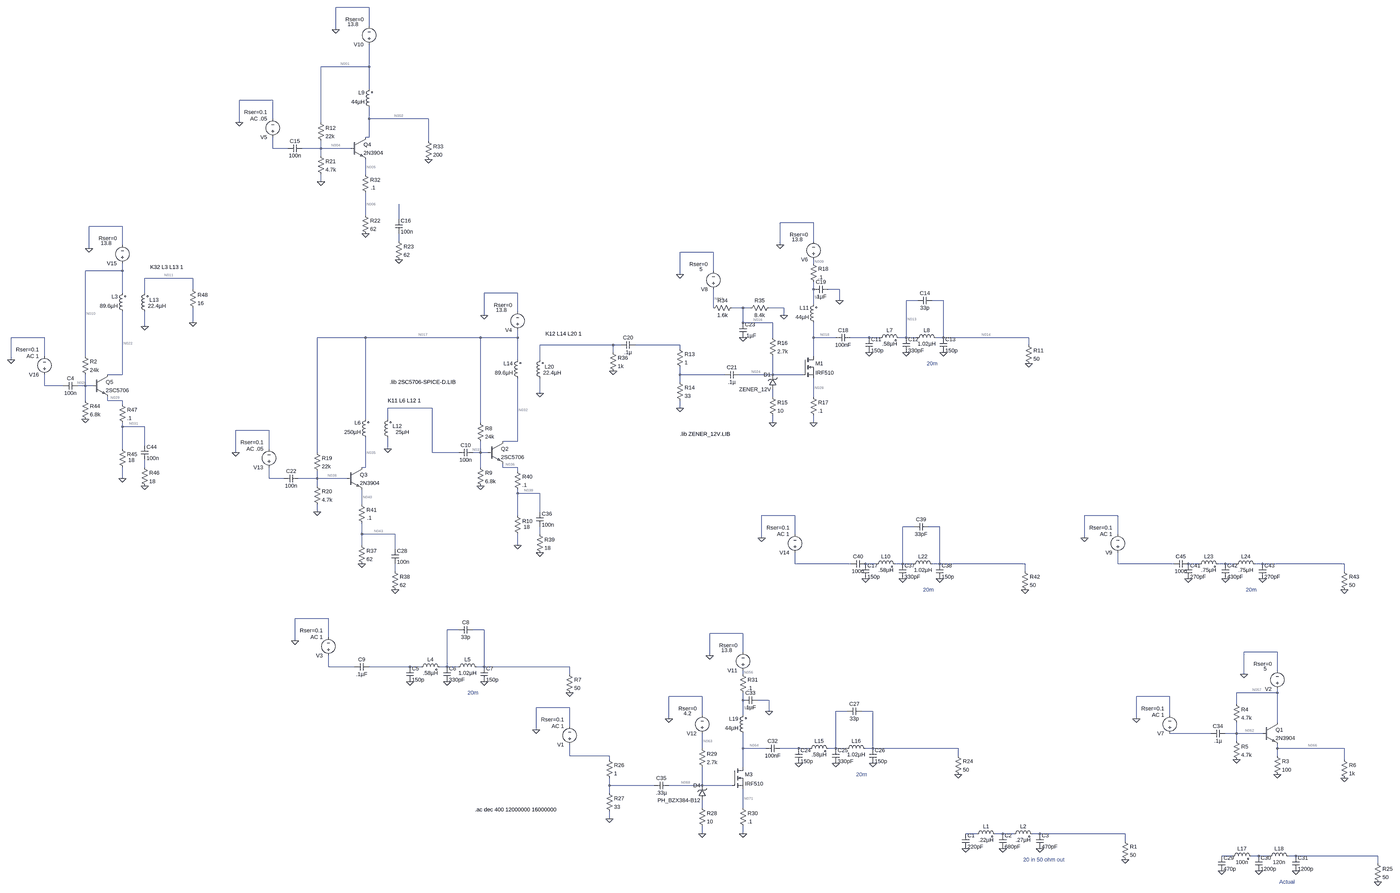
[diagram p0: schematic 10W IRF510 Amp - Impedance.asc, whole sheet]
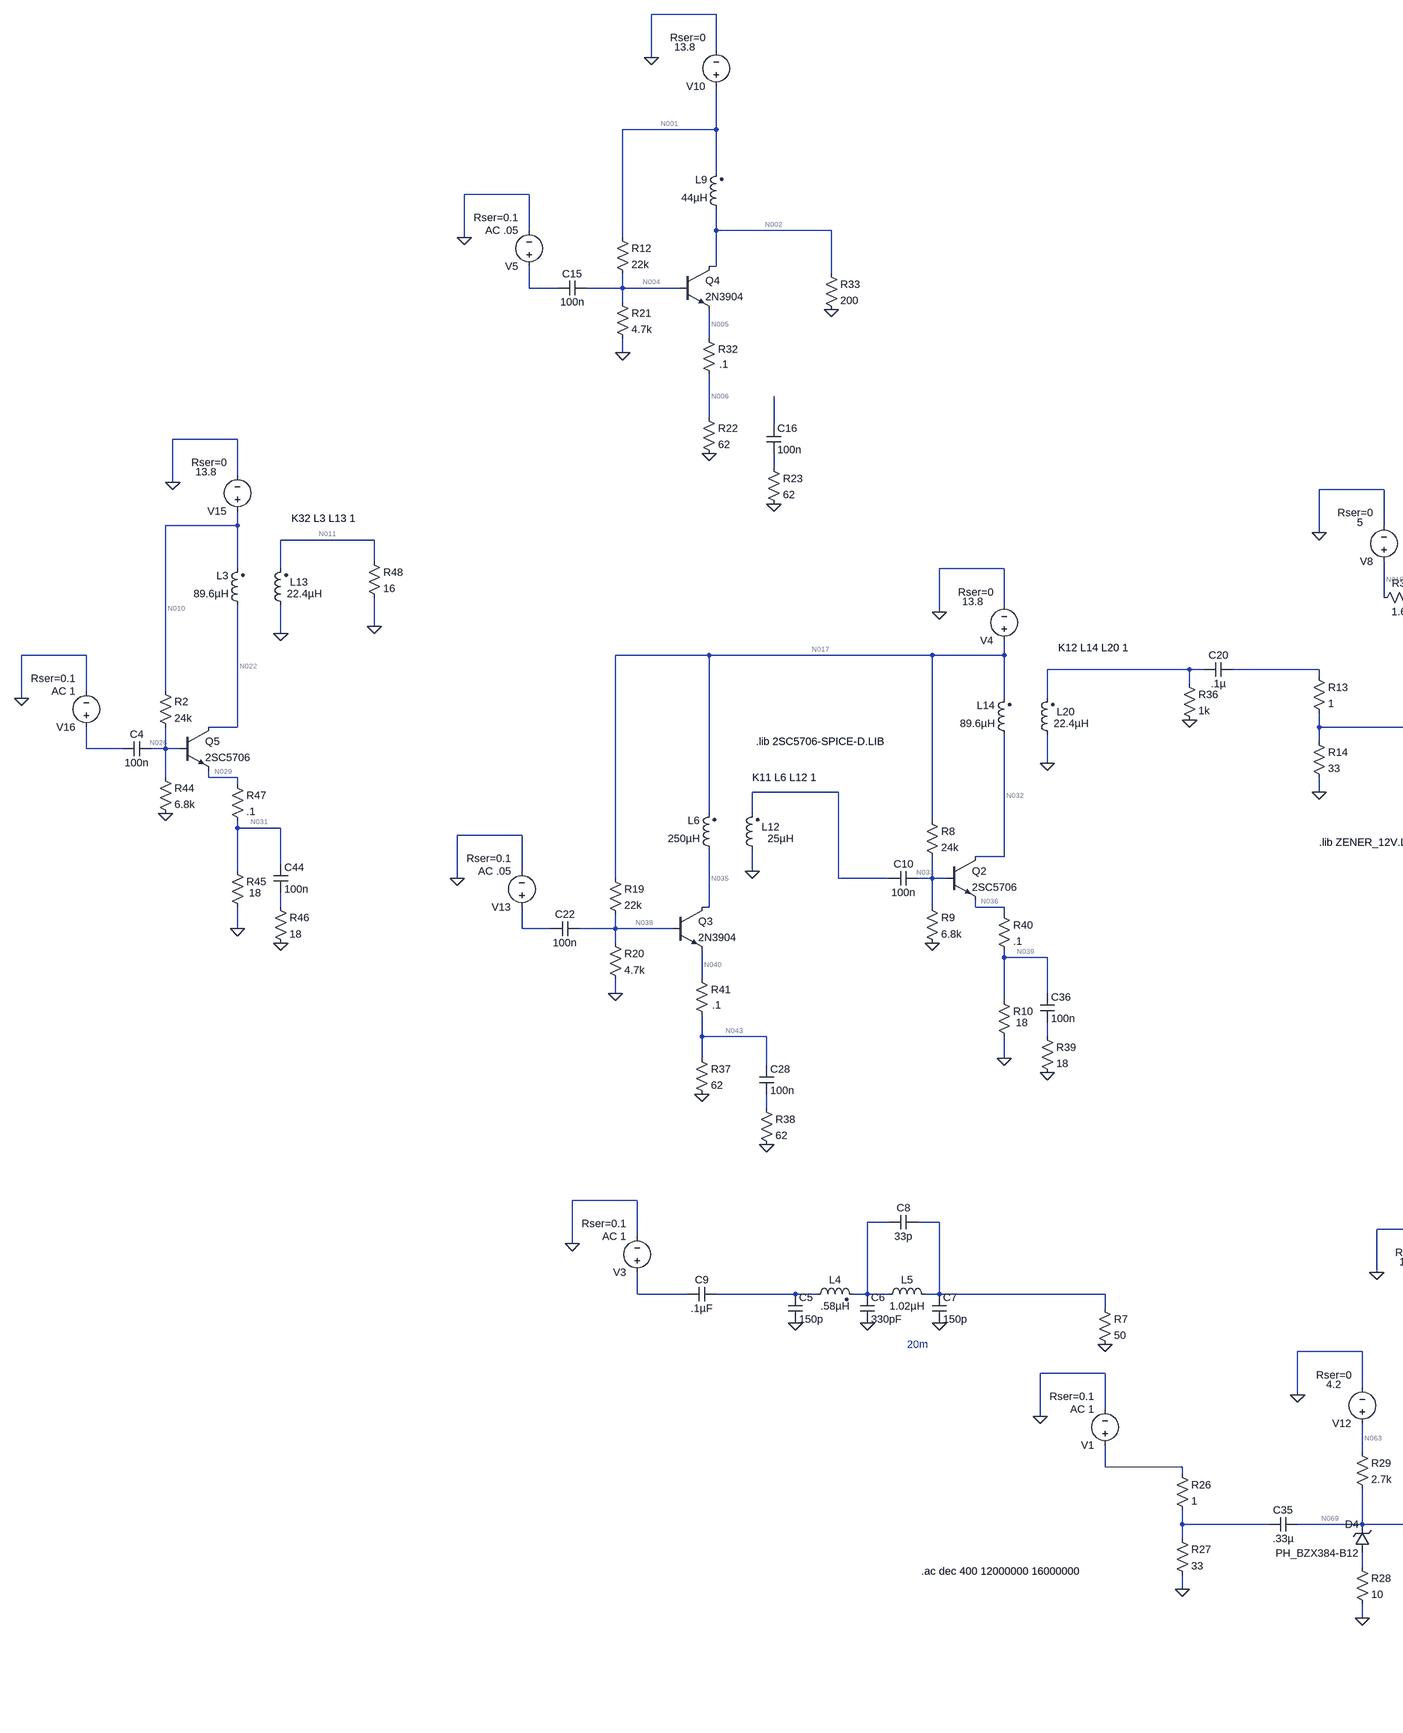
[diagram p1: schematic 10W IRF510 Amp - Impedance.asc, part, row 1 of 1, column 1 of 2]
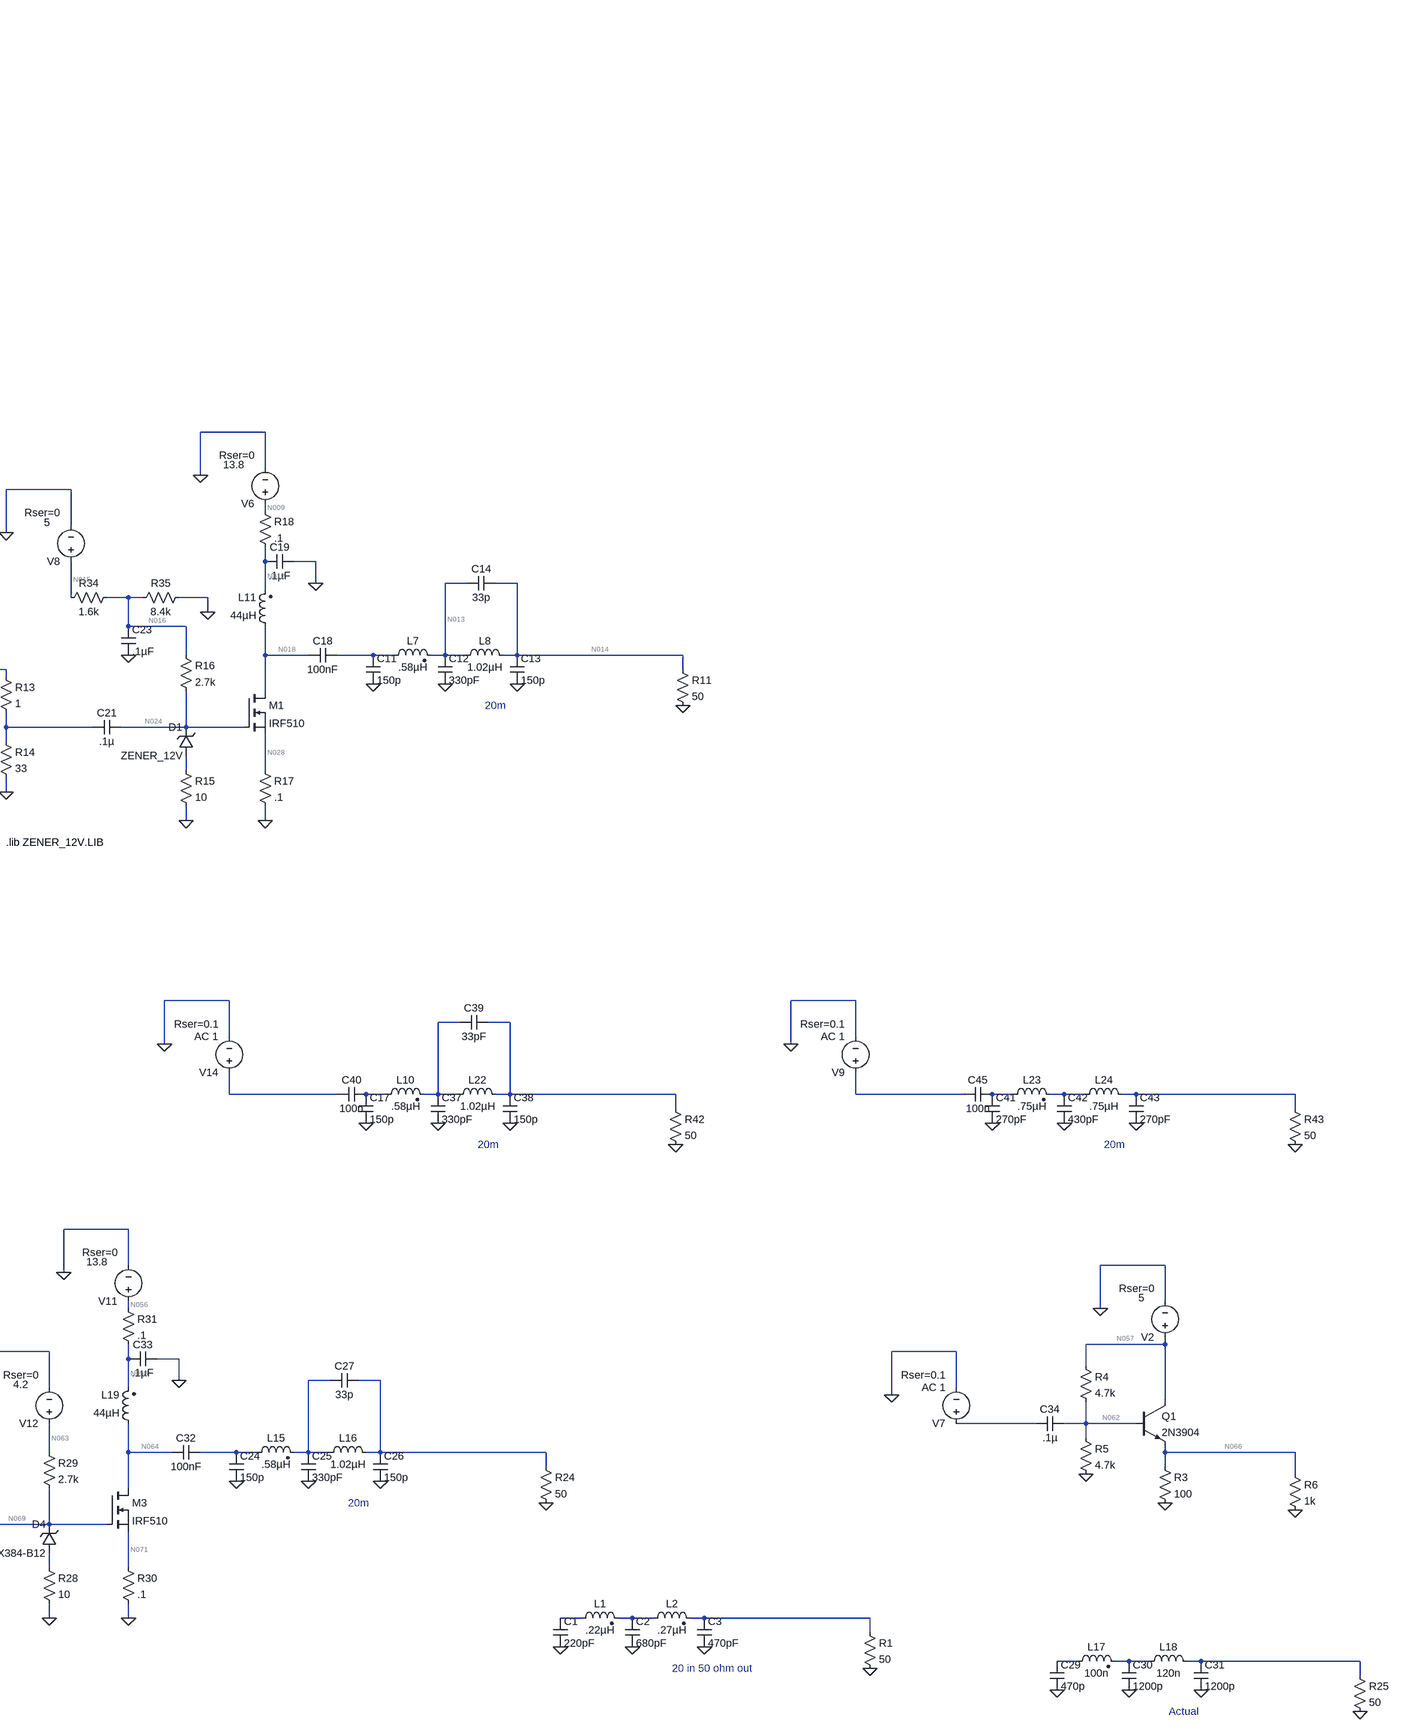
[diagram p2: schematic 10W IRF510 Amp - Impedance.asc, part, row 1 of 1, column 2 of 2]
10W IRF510 Amp - Impedance.asc, the LTspice schematic file:
Version 4
SHEET 1 3764 1240
WIRE -1216 -6752 -1360 -6752
WIRE -1216 -6672 -1216 -6752
WIRE -1360 -6656 -1360 -6752
WIRE -1216 -6496 -1216 -6592
WIRE -1216 -6496 -1424 -6496
WIRE -1216 -6400 -1216 -6496
WIRE -1632 -6352 -1776 -6352
WIRE -1632 -6272 -1632 -6352
WIRE -1216 -6272 -1216 -6320
WIRE -960 -6272 -1216 -6272
WIRE -1776 -6256 -1776 -6352
WIRE -1424 -6256 -1424 -6496
WIRE -1216 -6192 -1216 -6272
WIRE -1216 -6192 -1232 -6192
WIRE -960 -6176 -960 -6272
WIRE -1632 -6144 -1632 -6192
WIRE -1568 -6144 -1632 -6144
WIRE -1424 -6144 -1424 -6176
WIRE -1424 -6144 -1504 -6144
WIRE -1296 -6144 -1424 -6144
WIRE -1424 -6112 -1424 -6144
WIRE -1232 -6032 -1232 -6096
WIRE -1424 -6000 -1424 -6032
WIRE -1232 -5856 -1232 -5952
WIRE -1088 -5840 -1088 -5904
WIRE 720 -5824 576 -5824
WIRE -2320 -5808 -2464 -5808
WIRE -1088 -5744 -1088 -5776
WIRE 720 -5744 720 -5824
WIRE -2320 -5728 -2320 -5808
WIRE 576 -5728 576 -5824
WIRE -2464 -5712 -2464 -5808
WIRE 288 -5696 144 -5696
WIRE 720 -5648 720 -5664
WIRE -2320 -5616 -2320 -5648
WIRE -2320 -5616 -2480 -5616
WIRE 288 -5616 288 -5696
WIRE 144 -5600 144 -5696
WIRE -2016 -5584 -2224 -5584
WIRE -2016 -5536 -2016 -5584
WIRE 720 -5536 720 -5568
WIRE 832 -5536 784 -5536
WIRE -2320 -5520 -2320 -5616
WIRE -2224 -5520 -2224 -5584
WIRE -576 -5520 -720 -5520
WIRE 832 -5488 832 -5536
WIRE 1168 -5488 1120 -5488
WIRE 1280 -5488 1232 -5488
WIRE 720 -5472 720 -5536
WIRE 288 -5456 288 -5536
WIRE 416 -5456 368 -5456
WIRE 448 -5456 416 -5456
WIRE 592 -5456 528 -5456
WIRE -576 -5440 -576 -5520
WIRE -720 -5424 -720 -5520
WIRE 592 -5424 592 -5456
WIRE -2016 -5392 -2016 -5456
WIRE 416 -5392 416 -5456
WIRE 544 -5392 416 -5392
WIRE -2224 -5376 -2224 -5440
WIRE -2656 -5328 -2800 -5328
WIRE -1232 -5328 -1440 -5328
WIRE -736 -5328 -1232 -5328
WIRE -576 -5328 -576 -5360
WIRE -576 -5328 -736 -5328
WIRE 544 -5328 544 -5392
WIRE 720 -5328 720 -5392
WIRE 816 -5328 720 -5328
WIRE 960 -5328 880 -5328
WIRE 1008 -5328 960 -5328
WIRE 1120 -5328 1120 -5488
WIRE 1120 -5328 1088 -5328
WIRE 1168 -5328 1120 -5328
WIRE 1280 -5328 1280 -5488
WIRE 1280 -5328 1248 -5328
WIRE 1648 -5328 1280 -5328
WIRE -144 -5296 -480 -5296
WIRE -112 -5296 -144 -5296
WIRE 144 -5296 -48 -5296
WIRE 1648 -5296 1648 -5328
WIRE 144 -5280 144 -5296
WIRE -144 -5264 -144 -5296
WIRE -2656 -5248 -2656 -5328
WIRE -2480 -5248 -2480 -5616
WIRE 720 -5248 720 -5328
WIRE -2800 -5232 -2800 -5328
WIRE -576 -5232 -576 -5328
WIRE -480 -5232 -480 -5296
WIRE -2320 -5168 -2320 -5440
WIRE -2320 -5168 -2384 -5168
WIRE 144 -5168 144 -5200
WIRE 336 -5168 144 -5168
WIRE 544 -5168 544 -5248
WIRE 544 -5168 400 -5168
WIRE 672 -5168 544 -5168
WIRE 144 -5136 144 -5168
WIRE -2656 -5120 -2656 -5168
WIRE -2576 -5120 -2656 -5120
WIRE -2480 -5120 -2480 -5168
WIRE -2480 -5120 -2512 -5120
WIRE -2448 -5120 -2480 -5120
WIRE -480 -5088 -480 -5152
WIRE 544 -5072 544 -5104
WIRE 720 -5072 720 -5152
WIRE -2480 -5056 -2480 -5120
WIRE -2384 -5056 -2384 -5072
WIRE -2320 -5056 -2384 -5056
WIRE -2320 -5040 -2320 -5056
WIRE -944 -5024 -1136 -5024
WIRE 144 -5024 144 -5056
WIRE -1232 -4976 -1232 -5328
WIRE -1136 -4976 -1136 -5024
WIRE -736 -4960 -736 -5328
WIRE 544 -4960 544 -4992
WIRE 720 -4960 720 -4992
WIRE -2320 -4944 -2320 -4960
WIRE -2224 -4944 -2320 -4944
WIRE -1648 -4928 -1792 -4928
WIRE -576 -4880 -576 -5152
WIRE -576 -4880 -640 -4880
WIRE -2224 -4864 -2224 -4944
WIRE -2320 -4848 -2320 -4944
WIRE -1648 -4848 -1648 -4928
WIRE -1136 -4848 -1136 -4896
WIRE -1792 -4832 -1792 -4928
WIRE -1440 -4832 -1440 -5328
WIRE -944 -4832 -944 -5024
WIRE -832 -4832 -944 -4832
WIRE -736 -4832 -736 -4880
WIRE -736 -4832 -768 -4832
WIRE -704 -4832 -736 -4832
WIRE -2224 -4768 -2224 -4800
WIRE -1232 -4768 -1232 -4896
WIRE -1232 -4768 -1248 -4768
WIRE -736 -4768 -736 -4832
WIRE -640 -4768 -640 -4784
WIRE -576 -4768 -640 -4768
WIRE -576 -4752 -576 -4768
WIRE -2320 -4720 -2320 -4768
WIRE -1648 -4720 -1648 -4768
WIRE -1584 -4720 -1648 -4720
WIRE -1440 -4720 -1440 -4752
WIRE -1440 -4720 -1520 -4720
WIRE -1312 -4720 -1440 -4720
WIRE -1440 -4688 -1440 -4720
WIRE -576 -4656 -576 -4672
WIRE -480 -4656 -576 -4656
WIRE -1248 -4608 -1248 -4672
WIRE -1440 -4576 -1440 -4608
WIRE -480 -4576 -480 -4656
WIRE -576 -4560 -576 -4656
WIRE 640 -4560 496 -4560
WIRE 2032 -4560 1888 -4560
WIRE 1152 -4512 1104 -4512
WIRE 1264 -4512 1216 -4512
WIRE -1248 -4480 -1248 -4528
WIRE -1104 -4480 -1248 -4480
WIRE -480 -4480 -480 -4512
WIRE 640 -4480 640 -4560
WIRE 2032 -4480 2032 -4560
WIRE 496 -4464 496 -4560
WIRE 1888 -4464 1888 -4560
WIRE -1248 -4432 -1248 -4480
WIRE -576 -4432 -576 -4480
WIRE -1104 -4416 -1104 -4480
WIRE 640 -4352 640 -4400
WIRE 880 -4352 640 -4352
WIRE 992 -4352 944 -4352
WIRE 1104 -4352 1104 -4512
WIRE 1104 -4352 1072 -4352
WIRE 1152 -4352 1104 -4352
WIRE 1264 -4352 1264 -4512
WIRE 1264 -4352 1232 -4352
WIRE 1632 -4352 1264 -4352
WIRE 2032 -4352 2032 -4400
WIRE 2272 -4352 2032 -4352
WIRE 2384 -4352 2336 -4352
WIRE 2496 -4352 2464 -4352
WIRE 2544 -4352 2496 -4352
WIRE 2656 -4352 2624 -4352
WIRE 3024 -4352 2656 -4352
WIRE -1104 -4320 -1104 -4352
WIRE 1632 -4320 1632 -4352
WIRE 3024 -4320 3024 -4352
WIRE -1392 -3616 -1536 -3616
WIRE -832 -3568 -880 -3568
WIRE -720 -3568 -768 -3568
WIRE 416 -3552 272 -3552
WIRE -1392 -3536 -1392 -3616
WIRE -1536 -3520 -1536 -3616
WIRE 416 -3472 416 -3552
WIRE 2720 -3472 2576 -3472
WIRE 272 -3456 272 -3552
WIRE -1392 -3408 -1392 -3456
WIRE -1280 -3408 -1392 -3408
WIRE -1040 -3408 -1216 -3408
WIRE -992 -3408 -1040 -3408
WIRE -880 -3408 -880 -3568
WIRE -880 -3408 -912 -3408
WIRE -832 -3408 -880 -3408
WIRE -720 -3408 -720 -3568
WIRE -720 -3408 -752 -3408
WIRE -352 -3408 -720 -3408
WIRE 2720 -3392 2720 -3472
WIRE -352 -3376 -352 -3408
WIRE 416 -3376 416 -3392
WIRE 2576 -3376 2576 -3472
WIRE 2720 -3296 2720 -3312
WIRE 2720 -3296 2544 -3296
WIRE 240 -3280 96 -3280
WIRE 2256 -3280 2112 -3280
WIRE 416 -3264 416 -3296
WIRE 528 -3264 480 -3264
WIRE 2544 -3248 2544 -3296
WIRE -352 -3232 -496 -3232
WIRE 528 -3216 528 -3264
WIRE 864 -3216 816 -3216
WIRE 976 -3216 928 -3216
WIRE 240 -3200 240 -3280
WIRE 416 -3200 416 -3264
WIRE 2256 -3200 2256 -3280
WIRE 96 -3184 96 -3280
WIRE 2112 -3184 2112 -3280
WIRE 2720 -3168 2720 -3296
WIRE -352 -3152 -352 -3232
WIRE -496 -3136 -496 -3232
WIRE 2432 -3120 2256 -3120
WIRE 2544 -3120 2544 -3168
WIRE 2544 -3120 2496 -3120
WIRE 2656 -3120 2544 -3120
WIRE 2544 -3088 2544 -3120
WIRE 240 -3056 240 -3120
WIRE 416 -3056 416 -3120
WIRE 512 -3056 416 -3056
WIRE 656 -3056 576 -3056
WIRE 704 -3056 656 -3056
WIRE 816 -3056 816 -3216
WIRE 816 -3056 784 -3056
WIRE 864 -3056 816 -3056
WIRE 976 -3056 976 -3216
WIRE 976 -3056 944 -3056
WIRE 1344 -3056 976 -3056
WIRE 2720 -3056 2720 -3072
WIRE 3024 -3056 2720 -3056
WIRE -352 -3024 -352 -3072
WIRE -160 -3024 -352 -3024
WIRE 1344 -3024 1344 -3056
WIRE 2720 -3024 2720 -3056
WIRE -160 -3008 -160 -3024
WIRE 3024 -3008 3024 -3056
WIRE 416 -2976 416 -3056
WIRE -160 -2896 -160 -2928
WIRE 32 -2896 -160 -2896
WIRE 240 -2896 240 -2976
WIRE 240 -2896 96 -2896
WIRE 368 -2896 240 -2896
WIRE -160 -2864 -160 -2896
WIRE 240 -2800 240 -2832
WIRE 416 -2800 416 -2880
WIRE -160 -2752 -160 -2784
WIRE 240 -2688 240 -2720
WIRE 416 -2688 416 -2720
WIRE 1424 -2688 1376 -2688
WIRE 1536 -2688 1504 -2688
WIRE 1584 -2688 1536 -2688
WIRE 1696 -2688 1664 -2688
WIRE 2064 -2688 1696 -2688
WIRE 2064 -2656 2064 -2688
WIRE 2528 -2592 2480 -2592
WIRE 2640 -2592 2608 -2592
WIRE 2688 -2592 2640 -2592
WIRE 2800 -2592 2768 -2592
WIRE 3168 -2592 2800 -2592
WIRE 3168 -2560 3168 -2592
FLAG 2112 -3184 0
FLAG 1344 -2944 0
FLAG 656 -2992 0
FLAG 816 -2992 0
FLAG 976 -2992 0
FLAG 3168 -2480 0
FLAG 2480 -2528 0
FLAG 2640 -2528 0
FLAG 2800 -2528 0
FLAG 272 -3456 0
FLAG 528 -3216 0
FLAG -160 -2752 0
FLAG 240 -2688 0
FLAG 416 -2688 0
FLAG 96 -3184 0
FLAG 2064 -2576 0
FLAG 1376 -2624 0
FLAG 1536 -2624 0
FLAG 1696 -2624 0
FLAG -496 -3136 0
FLAG 2720 -2944 0
FLAG 2576 -3376 0
FLAG 2544 -3008 0
FLAG 3024 -2928 0
FLAG -352 -3296 0
FLAG -1040 -3344 0
FLAG -880 -3344 0
FLAG -720 -3344 0
FLAG -1536 -3520 0
FLAG -720 -5424 0
FLAG -736 -4688 0
FLAG -576 -4432 0
FLAG 1648 -5216 0
FLAG 960 -5264 0
FLAG 1120 -5264 0
FLAG 1280 -5264 0
FLAG 576 -5728 0
FLAG 832 -5488 0
FLAG 144 -5024 0
FLAG 544 -4960 0
FLAG 720 -4960 0
FLAG 144 -5600 0
FLAG -1440 -4576 0
FLAG 592 -5424 0
FLAG 416 -5328 0
FLAG -144 -5184 0
FLAG -1248 -4352 0
FLAG -1104 -4240 0
FLAG -1136 -4848 0
FLAG -480 -4400 0
FLAG -480 -5088 0
FLAG -1792 -4832 0
FLAG -1424 -6000 0
FLAG -1232 -5776 0
FLAG -1088 -5664 0
FLAG -1776 -6256 0
FLAG -1360 -6656 0
FLAG -960 -6096 0
FLAG 1632 -4240 0
FLAG 944 -4288 0
FLAG 1104 -4288 0
FLAG 1264 -4288 0
FLAG 496 -4464 0
FLAG 3024 -4240 0
FLAG 2336 -4288 0
FLAG 2496 -4288 0
FLAG 2656 -4288 0
FLAG 1888 -4464 0
FLAG -2464 -5712 0
FLAG -2480 -4976 0
FLAG -2320 -4720 0
FLAG -2224 -4688 0
FLAG -2224 -5376 0
FLAG -2016 -5392 0
FLAG -2800 -5232 0
SYMBOL voltage 2256 -3104 R180
WINDOW 123 24 96 Left 2
WINDOW 39 24 124 Left 2
WINDOW 3 46 103 Left 2
SYMATTR Value2 AC 1
SYMATTR SpiceLine Rser=0.1
SYMATTR Value ""
SYMATTR InstName V7
SYMBOL res 1328 -3040 R0
SYMATTR InstName R24
SYMATTR Value 50
SYMBOL cap 640 -3056 R0
SYMATTR InstName C24
SYMATTR Value 150p
SYMBOL cap 800 -3056 R0
SYMATTR InstName C25
SYMATTR Value 330pF
SYMBOL cap 960 -3056 R0
SYMATTR InstName C26
SYMATTR Value 150p
SYMBOL ind2 688 -3040 R270
WINDOW 0 32 56 VTop 2
WINDOW 3 5 56 VBottom 2
SYMATTR InstName L15
SYMATTR Value .58µH
SYMATTR Type ind
SYMBOL ind 848 -3040 R270
WINDOW 0 32 56 VTop 2
WINDOW 3 5 56 VBottom 2
SYMATTR InstName L16
SYMATTR Value 1.02µH
SYMBOL cap 928 -3232 R90
WINDOW 0 0 32 VBottom 2
WINDOW 3 32 32 VTop 2
SYMATTR InstName C27
SYMATTR Value 33p
SYMBOL res 3152 -2576 R0
SYMATTR InstName R25
SYMATTR Value 50
SYMBOL cap 2464 -2592 R0
SYMATTR InstName C29
SYMATTR Value 470p
SYMBOL cap 2624 -2592 R0
SYMATTR InstName C30
SYMATTR Value 1200p
SYMBOL cap 2784 -2592 R0
SYMATTR InstName C31
SYMATTR Value 1200p
SYMBOL ind2 2512 -2576 R270
WINDOW 0 32 56 VTop 2
WINDOW 3 5 56 VBottom 2
SYMATTR InstName L17
SYMATTR Value 100n
SYMATTR Type ind
SYMBOL ind 2672 -2576 R270
WINDOW 0 32 56 VTop 2
WINDOW 3 5 56 VBottom 2
SYMATTR InstName L18
SYMATTR Value 120n
SYMBOL voltage 416 -3376 R180
WINDOW 123 0 0 Left 0
WINDOW 39 24 124 Left 2
WINDOW 3 46 103 Left 2
SYMATTR SpiceLine Rser=0
SYMATTR Value 13.8
SYMATTR InstName V11
SYMBOL ind2 432 -3104 R180
WINDOW 0 36 80 Left 2
WINDOW 3 36 40 Left 2
SYMATTR InstName L19
SYMATTR Value 44µH
SYMATTR Type ind
SYMBOL cap 576 -3072 R90
WINDOW 0 0 32 VBottom 2
WINDOW 3 32 32 VTop 2
SYMATTR InstName C32
SYMATTR Value 100nF
SYMBOL cap 480 -3280 R90
WINDOW 0 0 32 VBottom 2
WINDOW 3 32 32 VTop 2
SYMATTR InstName C33
SYMATTR Value .1µF
SYMBOL cap 2496 -3136 R90
WINDOW 0 0 32 VBottom 2
WINDOW 3 32 32 VTop 2
SYMATTR InstName C34
SYMATTR Value .1µ
SYMBOL zener 256 -2832 R180
WINDOW 0 24 64 Left 2
WINDOW 3 24 0 Left 2
SYMATTR InstName D4
SYMATTR Value PH_BZX384-B12
SYMBOL res -176 -3024 R0
SYMATTR InstName R26
SYMATTR Value 1
SYMBOL res -176 -2880 R0
SYMATTR InstName R27
SYMATTR Value 33
SYMBOL cap 96 -2912 R90
WINDOW 0 0 32 VBottom 2
WINDOW 3 32 32 VTop 2
SYMATTR InstName C35
SYMATTR Value .33µ
SYMBOL res 224 -2816 R0
SYMATTR InstName R28
SYMATTR Value 10
SYMBOL nmos 368 -2976 R0
SYMATTR InstName M3
SYMATTR Value IRF510
SYMBOL res 224 -3072 R0
SYMATTR InstName R29
SYMATTR Value 2.7k
SYMBOL voltage 240 -3104 R180
WINDOW 123 0 0 Left 0
WINDOW 39 24 124 Left 2
WINDOW 3 46 103 Left 2
SYMATTR SpiceLine Rser=0
SYMATTR Value 4.2
SYMATTR InstName V12
SYMBOL res 400 -2816 R0
SYMATTR InstName R30
SYMATTR Value .1
SYMBOL res 400 -3392 R0
SYMATTR InstName R31
SYMATTR Value .1
SYMBOL res 2048 -2672 R0
SYMATTR InstName R1
SYMATTR Value 50
SYMBOL cap 1360 -2688 R0
SYMATTR InstName C1
SYMATTR Value 220pF
SYMBOL cap 1520 -2688 R0
SYMATTR InstName C2
SYMATTR Value 680pF
SYMBOL cap 1680 -2688 R0
SYMATTR InstName C3
SYMATTR Value 470pF
SYMBOL ind2 1408 -2672 R270
WINDOW 0 32 56 VTop 2
WINDOW 3 5 56 VBottom 2
SYMATTR InstName L1
SYMATTR Value .22µH
SYMATTR Type ind
SYMBOL ind2 1568 -2672 R270
WINDOW 0 32 56 VTop 2
WINDOW 3 5 56 VBottom 2
SYMATTR InstName L2
SYMATTR Value .27µH
SYMATTR Type ind
SYMBOL voltage -352 -3056 R180
WINDOW 123 24 96 Left 2
WINDOW 39 24 124 Left 2
WINDOW 3 46 103 Left 2
SYMATTR Value2 AC 1
SYMATTR SpiceLine Rser=0.1
SYMATTR Value ""
SYMATTR InstName V1
SYMBOL npn 2656 -3168 R0
SYMATTR InstName Q1
SYMATTR Value 2N3904
SYMBOL res 2704 -3040 R0
SYMATTR InstName R3
SYMATTR Value 100
SYMBOL voltage 2720 -3296 R180
WINDOW 123 0 0 Left 0
WINDOW 39 24 124 Left 2
WINDOW 3 46 103 Left 2
SYMATTR SpiceLine Rser=0
SYMATTR Value 5
SYMATTR InstName V2
SYMBOL res 2528 -3264 R0
SYMATTR InstName R4
SYMATTR Value 4.7k
SYMBOL res 2528 -3104 R0
SYMATTR InstName R5
SYMATTR Value 4.7k
SYMBOL res 3008 -3024 R0
SYMATTR InstName R6
SYMATTR Value 1k
SYMBOL res -368 -3392 R0
SYMATTR InstName R7
SYMATTR Value 50
SYMBOL cap -1056 -3408 R0
SYMATTR InstName C5
SYMATTR Value 150p
SYMBOL cap -896 -3408 R0
SYMATTR InstName C6
SYMATTR Value 330pF
SYMBOL cap -736 -3408 R0
SYMATTR InstName C7
SYMATTR Value 150p
SYMBOL ind2 -1008 -3392 R270
WINDOW 0 32 56 VTop 2
WINDOW 3 5 56 VBottom 2
SYMATTR InstName L4
SYMATTR Value .58µH
SYMATTR Type ind
SYMBOL ind -848 -3392 R270
WINDOW 0 32 56 VTop 2
WINDOW 3 5 56 VBottom 2
SYMATTR InstName L5
SYMATTR Value 1.02µH
SYMBOL cap -768 -3584 R90
WINDOW 0 0 32 VBottom 2
WINDOW 3 32 32 VTop 2
SYMATTR InstName C8
SYMATTR Value 33p
SYMBOL voltage -1392 -3440 R180
WINDOW 123 24 96 Left 2
WINDOW 39 24 124 Left 2
WINDOW 3 46 103 Left 2
SYMATTR Value2 AC 1
SYMATTR SpiceLine Rser=0.1
SYMATTR Value ""
SYMATTR InstName V3
SYMBOL cap -1216 -3424 R90
WINDOW 0 0 32 VBottom 2
WINDOW 3 32 32 VTop 2
SYMATTR InstName C9
SYMATTR Value .1µF
SYMBOL npn -704 -4880 R0
SYMATTR InstName Q2
SYMATTR Value 2SC5706
SYMBOL voltage -576 -5344 R180
WINDOW 123 0 0 Left 0
WINDOW 39 24 124 Left 2
WINDOW 3 46 103 Left 2
SYMATTR SpiceLine Rser=0
SYMATTR Value 13.8
SYMATTR InstName V4
SYMBOL npn -1312 -4768 R0
SYMATTR InstName Q3
SYMATTR Value 2N3904
SYMBOL cap -768 -4848 R90
WINDOW 0 0 32 VBottom 2
WINDOW 3 32 32 VTop 2
SYMATTR InstName C10
SYMATTR Value 100n
SYMBOL res -752 -4976 R0
SYMATTR InstName R8
SYMATTR Value 24k
SYMBOL res -752 -4784 R0
SYMATTR InstName R9
SYMATTR Value 6.8k
SYMBOL ind2 -1216 -4880 R180
WINDOW 0 36 80 Left 2
WINDOW 3 36 40 Left 2
SYMATTR InstName L6
SYMATTR Value 250µH
SYMATTR Type ind
SYMBOL res -592 -4576 R0
WINDOW 3 42 65 Left 2
SYMATTR Value 18
SYMATTR InstName R10
SYMBOL res 1632 -5312 R0
SYMATTR InstName R11
SYMATTR Value 50
SYMBOL cap 944 -5328 R0
SYMATTR InstName C11
SYMATTR Value 150p
SYMBOL cap 1104 -5328 R0
SYMATTR InstName C12
SYMATTR Value 330pF
SYMBOL cap 1264 -5328 R0
SYMATTR InstName C13
SYMATTR Value 150p
SYMBOL ind2 992 -5312 R270
WINDOW 0 32 56 VTop 2
WINDOW 3 5 56 VBottom 2
SYMATTR InstName L7
SYMATTR Value .58µH
SYMATTR Type ind
SYMBOL ind 1152 -5312 R270
WINDOW 0 32 56 VTop 2
WINDOW 3 5 56 VBottom 2
SYMATTR InstName L8
SYMATTR Value 1.02µH
SYMBOL cap 1232 -5504 R90
WINDOW 0 0 32 VBottom 2
WINDOW 3 32 32 VTop 2
SYMATTR InstName C14
SYMATTR Value 33p
SYMBOL voltage 720 -5648 R180
WINDOW 123 0 0 Left 0
WINDOW 39 24 124 Left 2
WINDOW 3 46 103 Left 2
SYMATTR SpiceLine Rser=0
SYMATTR Value 13.8
SYMATTR InstName V6
SYMBOL ind2 736 -5376 R180
WINDOW 0 36 80 Left 2
WINDOW 3 36 40 Left 2
SYMATTR InstName L11
SYMATTR Value 44µH
SYMATTR Type ind
SYMBOL cap 880 -5344 R90
WINDOW 0 0 32 VBottom 2
WINDOW 3 32 32 VTop 2
SYMATTR InstName C18
SYMATTR Value 100nF
SYMBOL ind2 -1120 -4880 R180
WINDOW 0 -45 66 Left 2
WINDOW 3 -76 40 Left 2
SYMATTR InstName L12
SYMATTR Value 25µH
SYMATTR Type ind
SYMBOL cap 784 -5552 R90
WINDOW 0 0 32 VBottom 2
WINDOW 3 32 32 VTop 2
SYMATTR InstName C19
SYMATTR Value .1µF
SYMBOL cap -48 -5312 R90
WINDOW 0 0 32 VBottom 2
WINDOW 3 32 32 VTop 2
SYMATTR InstName C20
SYMATTR Value .1µ
SYMBOL zener 560 -5104 R180
WINDOW 0 24 64 Left 2
WINDOW 3 24 0 Left 2
SYMATTR InstName D1
SYMATTR Value ZENER_12V
SYMBOL res 128 -5296 R0
SYMATTR InstName R13
SYMATTR Value 1
SYMBOL res 128 -5152 R0
SYMATTR InstName R14
SYMATTR Value 33
SYMBOL cap 400 -5184 R90
WINDOW 0 0 32 VBottom 2
WINDOW 3 32 32 VTop 2
SYMATTR InstName C21
SYMATTR Value .1µ
SYMBOL res 528 -5088 R0
SYMATTR InstName R15
SYMATTR Value 10
SYMBOL nmos 672 -5248 R0
SYMATTR InstName M1
SYMATTR Value IRF510
SYMBOL res 528 -5344 R0
SYMATTR InstName R16
SYMATTR Value 2.7k
SYMBOL voltage 288 -5520 R180
WINDOW 123 0 0 Left 0
WINDOW 39 24 124 Left 2
WINDOW 3 46 103 Left 2
SYMATTR SpiceLine Rser=0
SYMATTR Value 5
SYMATTR InstName V8
SYMBOL res 704 -5088 R0
SYMATTR InstName R17
SYMATTR Value .1
SYMBOL res 704 -5664 R0
SYMATTR InstName R18
SYMATTR Value .1
SYMBOL cap -1520 -4736 R90
WINDOW 0 0 32 VBottom 2
WINDOW 3 32 32 VTop 2
SYMATTR InstName C22
SYMATTR Value 100n
SYMBOL res -1456 -4848 R0
SYMATTR InstName R19
SYMATTR Value 22k
SYMATTR SpiceLine tol=4.7k
SYMBOL res -1456 -4704 R0
SYMATTR InstName R20
SYMATTR Value 4.7k
SYMBOL res 384 -5472 R90
WINDOW 0 0 56 VBottom 2
WINDOW 3 32 56 VTop 2
SYMATTR InstName R34
SYMATTR Value 1.6k
SYMBOL res 544 -5472 R90
WINDOW 0 0 56 VBottom 2
WINDOW 3 32 56 VTop 2
SYMATTR InstName R35
SYMATTR Value 8.4k
SYMBOL res -160 -5280 R0
SYMATTR InstName R36
SYMATTR Value 1k
SYMBOL cap 400 -5392 R0
SYMATTR InstName C23
SYMATTR Value .1µF
SYMBOL res -1264 -4448 R0
SYMATTR InstName R37
SYMATTR Value 62
SYMBOL res -1120 -4336 R0
SYMATTR InstName R38
SYMATTR Value 62
SYMBOL cap -1120 -4416 R0
SYMATTR InstName C28
SYMATTR Value 100n
SYMBOL res -496 -4496 R0
SYMATTR InstName R39
SYMATTR Value 18
SYMBOL cap -496 -4576 R0
SYMATTR InstName C36
SYMATTR Value 100n
SYMBOL ind2 -560 -5136 R180
WINDOW 0 36 80 Left 2
WINDOW 3 36 40 Left 2
SYMATTR InstName L14
SYMATTR Value 89.6µH
SYMATTR Type ind
SYMBOL ind2 -464 -5136 R180
WINDOW 0 -45 66 Left 2
WINDOW 3 -76 40 Left 2
SYMATTR InstName L20
SYMATTR Value 22.4µH
SYMATTR Type ind
SYMBOL res -592 -4768 R0
SYMATTR InstName R40
SYMATTR Value .1
SYMBOL res -1264 -4624 R0
WINDOW 3 39 74 Left 2
SYMATTR Value .1
SYMATTR InstName R41
SYMBOL npn -1296 -6192 R0
SYMATTR InstName Q4
SYMATTR Value 2N3904
SYMBOL cap -1504 -6160 R90
WINDOW 0 0 32 VBottom 2
WINDOW 3 32 32 VTop 2
SYMATTR InstName C15
SYMATTR Value 100n
SYMBOL res -1440 -6272 R0
SYMATTR InstName R12
SYMATTR Value 22k
SYMBOL res -1440 -6128 R0
SYMATTR InstName R21
SYMATTR Value 4.7k
SYMBOL res -1248 -5872 R0
SYMATTR InstName R22
SYMATTR Value 62
SYMBOL res -1104 -5760 R0
SYMATTR InstName R23
SYMATTR Value 62
SYMBOL cap -1104 -5840 R0
SYMATTR InstName C16
SYMATTR Value 100n
SYMBOL res -1248 -6048 R0
WINDOW 3 39 74 Left 2
SYMATTR Value .1
SYMATTR InstName R32
SYMBOL voltage -1632 -6176 R180
WINDOW 123 24 96 Left 2
WINDOW 39 24 124 Left 2
WINDOW 3 46 103 Left 2
SYMATTR Value2 AC .05
SYMATTR SpiceLine Rser=0.1
SYMATTR Value ""
SYMATTR InstName V5
SYMBOL ind2 -1200 -6304 R180
WINDOW 0 36 80 Left 2
WINDOW 3 36 40 Left 2
SYMATTR InstName L9
SYMATTR Value 44µH
SYMATTR Type ind
SYMBOL voltage -1216 -6576 R180
WINDOW 123 0 0 Left 0
WINDOW 39 24 124 Left 2
WINDOW 3 46 103 Left 2
SYMATTR SpiceLine Rser=0
SYMATTR Value 13.8
SYMATTR InstName V10
SYMBOL res -976 -6192 R0
SYMATTR InstName R33
SYMATTR Value 200
SYMBOL res 1616 -4336 R0
SYMATTR InstName R42
SYMATTR Value 50
SYMBOL cap 928 -4352 R0
SYMATTR InstName C17
SYMATTR Value 150p
SYMBOL cap 1088 -4352 R0
SYMATTR InstName C37
SYMATTR Value 330pF
SYMBOL cap 1248 -4352 R0
SYMATTR InstName C38
SYMATTR Value 150p
SYMBOL ind2 976 -4336 R270
WINDOW 0 32 56 VTop 2
WINDOW 3 5 56 VBottom 2
SYMATTR InstName L10
SYMATTR Value .58µH
SYMATTR Type ind
SYMBOL ind 1136 -4336 R270
WINDOW 0 32 56 VTop 2
WINDOW 3 5 56 VBottom 2
SYMATTR InstName L22
SYMATTR Value 1.02µH
SYMBOL cap 1216 -4528 R90
WINDOW 0 0 32 VBottom 2
WINDOW 3 32 32 VTop 2
SYMATTR InstName C39
SYMATTR Value 33pF
SYMBOL voltage -1648 -4752 R180
WINDOW 123 24 96 Left 2
WINDOW 39 24 124 Left 2
WINDOW 3 46 103 Left 2
SYMATTR Value2 AC .05
SYMATTR SpiceLine Rser=0.1
SYMATTR Value ""
SYMATTR InstName V13
SYMBOL cap 944 -4368 R90
WINDOW 0 0 32 VBottom 2
WINDOW 3 32 32 VTop 2
SYMATTR InstName C40
SYMATTR Value 100n
SYMBOL voltage 640 -4384 R180
WINDOW 123 24 96 Left 2
WINDOW 39 24 124 Left 2
WINDOW 3 46 103 Left 2
SYMATTR Value2 AC 1
SYMATTR SpiceLine Rser=0.1
SYMATTR Value ""
SYMATTR InstName V14
SYMBOL res 3008 -4336 R0
SYMATTR InstName R43
SYMATTR Value 50
SYMBOL cap 2320 -4352 R0
SYMATTR InstName C41
SYMATTR Value 270pF
SYMBOL cap 2480 -4352 R0
SYMATTR InstName C42
SYMATTR Value 430pF
SYMBOL cap 2640 -4352 R0
SYMATTR InstName C43
SYMATTR Value 270pF
SYMBOL ind2 2368 -4336 R270
WINDOW 0 32 56 VTop 2
WINDOW 3 5 56 VBottom 2
SYMATTR InstName L23
SYMATTR Value .75µH
SYMATTR Type ind
SYMBOL ind 2528 -4336 R270
WINDOW 0 32 56 VTop 2
WINDOW 3 5 56 VBottom 2
SYMATTR InstName L24
SYMATTR Value .75µH
SYMBOL cap 2336 -4368 R90
WINDOW 0 0 32 VBottom 2
WINDOW 3 32 32 VTop 2
SYMATTR InstName C45
SYMATTR Value 100n
SYMBOL voltage 2032 -4384 R180
WINDOW 123 24 96 Left 2
WINDOW 39 24 124 Left 2
WINDOW 3 46 103 Left 2
SYMATTR Value2 AC 1
SYMATTR SpiceLine Rser=0.1
SYMATTR Value ""
SYMATTR InstName V9
SYMBOL npn -2448 -5168 R0
SYMATTR InstName Q5
SYMATTR Value 2SC5706
SYMBOL voltage -2320 -5632 R180
WINDOW 123 0 0 Left 0
WINDOW 39 24 124 Left 2
WINDOW 3 46 103 Left 2
SYMATTR SpiceLine Rser=0
SYMATTR Value 13.8
SYMATTR InstName V15
SYMBOL cap -2512 -5136 R90
WINDOW 0 0 32 VBottom 2
WINDOW 3 32 32 VTop 2
SYMATTR InstName C4
SYMATTR Value 100n
SYMBOL res -2496 -5264 R0
SYMATTR InstName R2
SYMATTR Value 24k
SYMBOL res -2496 -5072 R0
SYMATTR InstName R44
SYMATTR Value 6.8k
SYMBOL res -2336 -4864 R0
WINDOW 3 42 65 Left 2
SYMATTR Value 18
SYMATTR InstName R45
SYMBOL res -2240 -4784 R0
SYMATTR InstName R46
SYMATTR Value 18
SYMBOL cap -2240 -4864 R0
SYMATTR InstName C44
SYMATTR Value 100n
SYMBOL ind2 -2304 -5424 R180
WINDOW 0 36 80 Left 2
WINDOW 3 36 40 Left 2
SYMATTR InstName L3
SYMATTR Value 89.6µH
SYMATTR Type ind
SYMBOL ind2 -2208 -5424 R180
WINDOW 0 -45 66 Left 2
WINDOW 3 -76 40 Left 2
SYMATTR InstName L13
SYMATTR Value 22.4µH
SYMATTR Type ind
SYMBOL res -2336 -5056 R0
SYMATTR InstName R47
SYMATTR Value .1
SYMBOL res -2032 -5552 R0
SYMATTR InstName R48
SYMATTR Value 16
SYMBOL voltage -2656 -5152 R180
WINDOW 123 24 96 Left 2
WINDOW 39 24 124 Left 2
WINDOW 3 46 103 Left 2
SYMATTR Value2 AC 1
SYMATTR SpiceLine Rser=0.1
SYMATTR Value ""
SYMATTR InstName V16
TEXT 904 -2944 Left 2 ;20m
TEXT 2728 -2480 Left 2 ;Actual
TEXT -760 -2792 Left 2 !.ac dec 400 12000000 16000000
TEXT 1624 -2576 Left 2 ;20 in 50 ohm out
TEXT -792 -3296 Left 2 ;20m
TEXT -1128 -5136 Left 2 !.lib 2SC5706-SPICE-D.LIB
TEXT 1208 -5216 Left 2 ;20m
TEXT -456 -5344 Left 2 !K12 L14 L20 1
TEXT -1136 -5056 Left 2 !K11 L6 L12 1
TEXT 144 -4912 Left 2 !.lib ZENER_12V.LIB
TEXT 1192 -4240 Left 2 ;20m
TEXT 2584 -4240 Left 2 ;20m
TEXT -2200 -5632 Left 2 !K32 L3 L13 1

The netlist it stands for:
* 10W IRF510 Amp - Impedance.asc
V7 N061 0 AC 1 Rser=0.1
R24 N060 0 50
C24 N065 0 150p
C25 N059 0 330pF
C26 N060 0 150p
L15 N065 N059 .58µH
L16 N059 N060 1.02µH
C27 N060 N059 33p
R25 N077 0 50
C29 N075 0 470p
C30 N076 0 1200p
C31 N077 0 1200p
L17 N075 N076 100n
L18 N076 N077 120n
V11 N056 0 13.8 Rser=0
L19 N064 N058 44µH
C32 N065 N064 100nF
C33 0 N058 .1µF
C34 N062 N061 .1µ
D4 N070 N069 PH_BZX384-B12
R26 N067 N068 1
R27 N068 0 33
C35 N069 N068 .33µ
R28 N070 0 10
M3 N064 N069 N071 N071 IRF510
R29 N063 N069 2.7k
V12 N063 0 4.2 Rser=0
R30 N071 0 .1
R31 N056 N058 .1
R1 N074 0 50
C1 N072 0 220pF
C2 N073 0 680pF
C3 N074 0 470pF
L1 N072 N073 .22µH
L2 N073 N074 .27µH
V1 N067 0 AC 1 Rser=0.1
Q1 N057 N062 N066 0 2N3904
R3 N066 0 100
V2 N057 0 5 Rser=0
R4 N057 N062 4.7k
R5 N062 0 4.7k
R6 N066 0 1k
R7 N053 0 50
C5 N055 0 150p
C6 N052 0 330pF
C7 N053 0 150p
L4 N055 N052 .58µH
L5 N052 N053 1.02µH
C8 N053 N052 33p
V3 N054 0 AC 1 Rser=0.1
C9 N055 N054 .1µF
Q2 N032 N033 N036 0 2SC5706
V4 N017 0 13.8 Rser=0
Q3 N035 N038 N040 0 2N3904
C10 N033 N030 100n
R8 N017 N033 24k
R9 N033 0 6.8k
L6 N035 N017 250µH
R10 N039 0 18
R11 N014 0 50
C11 N019 0 150p
C12 N013 0 330pF
C13 N014 0 150p
L7 N019 N013 .58µH
L8 N013 N014 1.02µH
C14 N014 N013 33p
V6 N009 0 13.8 Rser=0
L11 N018 N012 44µH
C18 N019 N018 100nF
L12 0 N030 25µH
C19 0 N012 .1µF
C20 N021 N020 .1µ
D1 N027 N024 ZENER_12V
R13 N021 N023 1
R14 N023 0 33
C21 N024 N023 .1µ
R15 N027 0 10
M1 N018 N024 N028 N028 IRF510
R16 N016 N024 2.7k
V8 N015 0 5 Rser=0
R17 N028 0 .1
R18 N009 N012 .1
C22 N038 N037 100n
R19 N017 N038 22k tol=4.7k
R20 N038 0 4.7k
R34 N016 N015 1.6k
R35 0 N016 8.4k
R36 N020 0 1k
C23 N016 0 .1µF
R37 N043 0 62
R38 N051 0 62
C28 N043 N051 100n
R39 N044 0 18
C36 N039 N044 100n
L14 N032 N017 89.6µH
L20 0 N020 22.4µH
R40 N036 N039 .1
R41 N040 N043 .1
Q4 N002 N004 N005 0 2N3904
C15 N004 N003 100n
R12 N001 N004 22k
R21 N004 0 4.7k
R22 N006 0 62
R23 N008 0 62
C16 N007 N008 100n
R32 N005 N006 .1
V5 N003 0 AC .05 Rser=0.1
L9 N002 N001 44µH
V10 N001 0 13.8 Rser=0
R33 N002 0 200
R42 N042 0 50
C17 N046 0 150p
C37 N041 0 330pF
C38 N042 0 150p
L10 N046 N041 .58µH
L22 N041 N042 1.02µH
C39 N042 N041 33pF
V13 N037 0 AC .05 Rser=0.1
C40 N046 N045 100n
V14 N045 0 AC 1 Rser=0.1
R43 N050 0 50
C41 N048 0 270pF
C42 N049 0 430pF
C43 N050 0 270pF
L23 N048 N049 .75µH
L24 N049 N050 .75µH
C45 N048 N047 100n
V9 N047 0 AC 1 Rser=0.1
Q5 N022 N026 N029 0 2SC5706
V15 N010 0 13.8 Rser=0
C4 N026 N025 100n
R2 N010 N026 24k
R44 N026 0 6.8k
R45 N031 0 18
R46 N034 0 18
C44 N031 N034 100n
L3 N022 N010 89.6µH
L13 0 N011 22.4µH
R47 N029 N031 .1
R48 N011 0 16
V16 N025 0 AC 1 Rser=0.1
.model D D
.lib standard.dio
.model NPN NPN
.model PNP PNP
.lib standard.bjt
.model NMOS NMOS
.model PMOS PMOS
.lib standard.mos
* 20m
* Actual
.ac dec 400 12000000 16000000
* 20 in 50 ohm out
* 20m
.lib 2SC5706-SPICE-D.LIB
* 20m
K12 L14 L20 1
K11 L6 L12 1
.lib ZENER_12V.LIB
* 20m
* 20m
K32 L3 L13 1
.backanno
.end

* Results of the author's LTspice run, read from the files saved beside the schematic
* Operating Point, zero values left out:
*   V(n056) = 13.8 V
*   V(n064) = 13.79 V
*   V(n058) = 13.79 V
*   V(n062) = 2.358 V
*   V(n069) = 4.2 V
*   V(n071) = 10.97 mV
*   V(n063) = 4.2 V
*   V(n057) = 5 V
*   V(n066) = 1.625 V
*   V(n032) = 13.8 V
*   V(n033) = 2.425 V
*   V(n036) = 1.773 V
*   V(n017) = 13.8 V
*   V(n035) = 13.8 V
*   V(n038) = 2.153 V
*   V(n040) = 1.415 V
*   V(n039) = 1.763 V
*   V(n009) = 13.8 V
*   V(n018) = 13.79 V
*   V(n012) = 13.79 V
*   V(n024) = 4.2 V
*   V(n028) = 10.97 mV
*   V(n016) = 4.2 V
*   V(n015) = 5 V
*   V(n043) = 1.413 V
*   V(n002) = 13.8 V
*   V(n004) = 2.153 V
*   V(n005) = 1.415 V
*   V(n001) = 13.8 V
*   V(n006) = 1.413 V
*   V(n022) = 13.8 V
*   V(n026) = 2.425 V
*   V(n029) = 1.773 V
*   V(n010) = 13.8 V
*   V(n031) = 1.763 V
*   Ic(Q5) = 97.85 mA
*   Ib(Q5) = 117.3 µA
*   Ie(Q5) = -97.97 mA
*   Ic(Q2) = 97.85 mA
*   Ib(Q2) = 117.3 µA
*   Ie(Q2) = -97.97 mA
*   Ic(Q4) = 22.72 mA
*   Ib(Q4) = 71.27 µA
*   Ie(Q4) = -22.79 mA
*   Ic(Q3) = 22.72 mA
*   Ib(Q3) = 71.27 µA
*   Ie(Q3) = -22.79 mA
*   Ic(Q1) = 17.82 mA
*   Ib(Q1) = 60.37 µA
*   Ie(Q1) = -17.88 mA
*   Id(M1) = 109.7 mA
*   Ig(M1) = -88.91 pA
*   Is(M1) = -109.7 mA
*   Id(M3) = 109.7 mA
*   Ig(M3) = -88.91 pA
*   Is(M3) = -109.7 mA
*   I(D1) = -4.211 pA
*   I(D4) = -4.211 pA
*   I(L3) = -97.85 mA
*   I(L9) = -91.72 mA
*   I(L14) = -97.85 mA
*   I(L11) = -109.7 mA
*   I(L6) = -22.72 mA
*   I(L19) = -109.7 mA
*   I(R47) = 97.97 mA
*   I(R45) = 97.97 mA
*   I(R44) = 356.7 µA
*   I(R2) = 473.9 µA
*   I(R33) = 69 mA
*   I(R32) = 22.79 mA
*   I(R22) = 22.79 mA
*   I(R21) = 458.1 µA
*   I(R12) = 529.4 µA
*   I(R41) = 22.79 mA
*   I(R40) = 97.97 mA
*   I(R37) = 22.79 mA
*   I(R35) = -500 µA
*   I(R34) = -500 µA
*   I(R20) = 458.1 µA
*   I(R19) = 529.4 µA
*   I(R18) = 109.7 mA
*   I(R17) = 109.7 mA
*   I(R16) = 4.211 pA
*   I(R15) = 4.211 pA
*   I(R10) = 97.97 mA
*   I(R9) = 356.7 µA
*   I(R8) = 473.9 µA
*   I(R6) = 1.625 mA
*   I(R5) = 501.7 µA
*   I(R4) = 562.1 µA
*   I(R3) = 16.25 mA
*   I(R31) = 109.7 mA
*   I(R30) = 109.7 mA
*   I(R29) = 4.211 pA
*   I(R28) = 4.211 pA
*   I(V15) = -98.32 mA
*   I(V10) = -92.25 mA
*   I(V8) = -500 µA
*   I(V6) = -109.7 mA
*   I(V4) = -121.6 mA
*   I(V2) = -18.38 mA
*   I(V12) = -4.211 pA
*   I(V11) = -109.7 mA
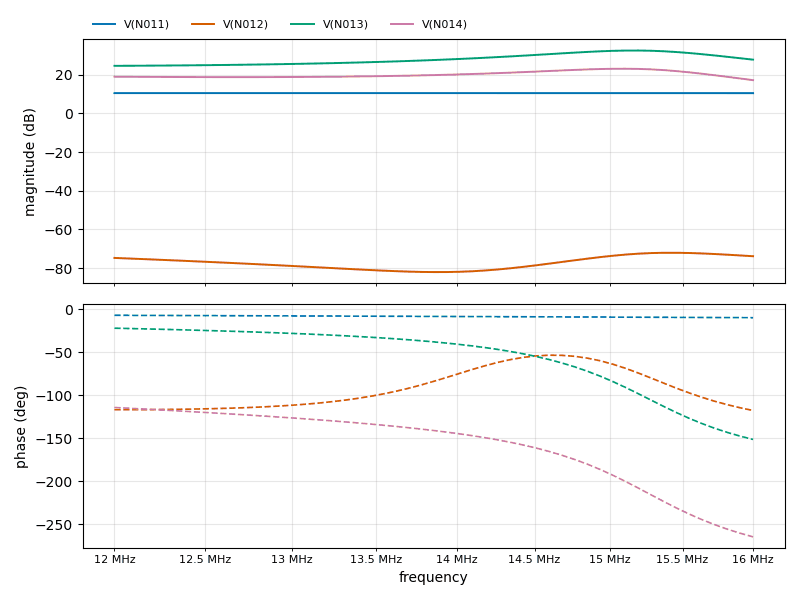
[diagram p3: AC Analysis of 10W IRF510 Amp - Impedance.asc, plotted from the saved traces]
* AC Analysis, 1 run:
*   V(N011): 10.46 dB at 12 MHz, 10.43 dB at 16 MHz, peak 10.46 dB at 12 MHz
*   V(N012): -74.71 dB at 12 MHz, -73.84 dB at 16 MHz, peak -72.04 dB at 15.46 MHz, 3 dB below the peak at 14.85 MHz
*   V(N013): 24.54 dB at 12 MHz, 27.74 dB at 16 MHz, peak 32.45 dB at 15.19 MHz, 3 dB below the peak at 14.35 MHz and 15.78 MHz
*   V(N014): 18.95 dB at 12 MHz, 17.14 dB at 16 MHz, peak 23.05 dB at 15.11 MHz, 3 dB below the peak at 13.98 MHz and 15.68 MHz